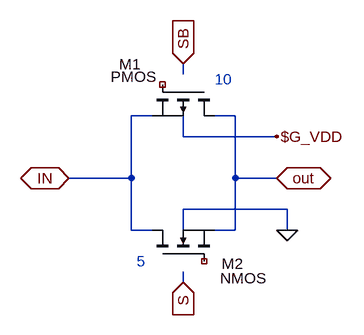
[diagram p0: schematic tg.asc]
tg.asc, the LTspice schematic file:
Version 4
SHEET 1 1292 680
WIRE -1216 -400 -1216 -416
WIRE -1264 -336 -1296 -336
WIRE -1136 -336 -1168 -336
WIRE -1216 -304 -1216 -336
WIRE -1072 -304 -1216 -304
WIRE -1296 -240 -1296 -336
WIRE -1296 -240 -1392 -240
WIRE -1136 -240 -1136 -336
WIRE -1072 -240 -1136 -240
WIRE -1056 -192 -1216 -192
WIRE -1296 -160 -1296 -240
WIRE -1264 -160 -1296 -160
WIRE -1216 -160 -1216 -192
WIRE -1136 -160 -1136 -240
WIRE -1136 -160 -1168 -160
WIRE -1056 -160 -1056 -192
WIRE -1216 -80 -1216 -96
FLAG -1072 -240 out
IOPIN -1072 -240 BiDir
FLAG -1072 -304 $G_VDD
FLAG -1392 -240 IN
IOPIN -1392 -240 BiDir
FLAG -1216 -80 S
IOPIN -1216 -80 In
FLAG -1216 -416 SB
IOPIN -1216 -416 In
FLAG -1056 -160 0
SYMBOL pmos -1168 -384 R90
WINDOW 0 -31 113 VRight 0
WINDOW 3 -12 89 VRight 0
SYMATTR InstName M1
SYMATTR Value2 l=0.6u w=3u
SYMBOL nmos -1264 -112 R270
WINDOW 0 -4 107 VRight 0
WINDOW 3 -26 105 VRight 0
SYMATTR InstName M2
SYMATTR Value2 l=0.6u w=1.5u
TEXT -1168 -392 Left 0 ;10
TEXT -1288 -112 Left 0 ;5

The netlist it stands for:
* tg.asc
* M1: PMOS l=0.6u w=3u (symbol pmos not certain, pin order unknown); nets seen at it: IN, out
* M2: NMOS l=0.6u w=1.5u (symbol nmos not certain, pin order unknown); nets seen at it: IN, out
* 10
* 5
.backanno
.end